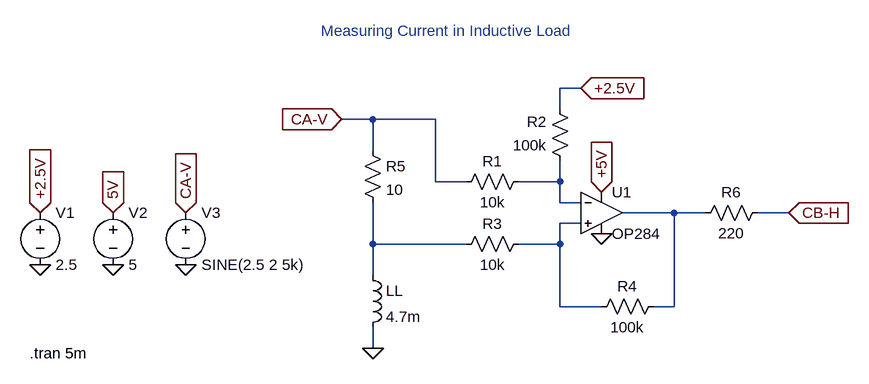
[diagram p0: schematic measuring_current_ind_load_ltspice.asc]
measuring_current_ind_load_ltspice.asc, the LTspice schematic file:
Version 4
SHEET 1 880 680
WIRE 256 240 224 240
WIRE 224 272 224 240
WIRE -64 288 -112 288
WIRE 32 288 -64 288
WIRE -64 336 -64 288
WIRE 32 384 32 288
WIRE 80 384 32 384
WIRE 224 384 224 352
WIRE 224 384 160 384
WIRE 224 416 224 384
WIRE 256 416 224 416
WIRE 400 432 320 432
WIRE 448 432 400 432
WIRE 576 432 528 432
WIRE 256 448 224 448
WIRE -64 480 -64 416
WIRE 80 480 -64 480
WIRE 224 480 224 448
WIRE 224 480 160 480
WIRE -64 528 -64 480
WIRE 224 576 224 480
WIRE 288 576 224 576
WIRE 400 576 400 432
WIRE 400 576 368 576
WIRE -64 640 -64 608
FLAG 288 464 0
FLAG 288 400 +5V
IOPIN 288 400 In
FLAG -112 288 CA-V
IOPIN -112 288 In
FLAG 256 240 +2.5V
IOPIN 256 240 In
FLAG 576 432 CB-H
IOPIN 576 432 In
FLAG -64 640 0
FLAG -576 512 0
FLAG -464 512 0
FLAG -352 512 0
FLAG -576 432 +2.5V
IOPIN -576 432 In
FLAG -464 432 5V
IOPIN -464 432 In
FLAG -352 432 CA-V
IOPIN -352 432 In
SYMBOL Opamps\\OP284 288 368 R0
SYMATTR InstName U1
SYMBOL res 176 368 R90
WINDOW 0 0 56 VBottom 2
WINDOW 3 32 56 VTop 2
SYMATTR InstName R1
SYMATTR Value 10k
SYMBOL res 240 368 R180
WINDOW 0 36 76 Left 2
WINDOW 3 36 40 Left 2
SYMATTR InstName R2
SYMATTR Value 100k
SYMBOL res 64 496 R270
WINDOW 0 32 56 VTop 2
WINDOW 3 0 56 VBottom 2
SYMATTR InstName R3
SYMATTR Value 10k
SYMBOL res 272 592 R270
WINDOW 0 32 56 VTop 2
WINDOW 3 0 56 VBottom 2
SYMATTR InstName R4
SYMATTR Value 100k
SYMBOL res -80 320 R0
SYMATTR InstName R5
SYMATTR Value 10
SYMBOL res 544 416 R90
WINDOW 0 0 56 VBottom 2
WINDOW 3 32 56 VTop 2
SYMATTR InstName R6
SYMATTR Value 220
SYMBOL voltage -576 416 R0
WINDOW 123 0 0 Left 0
WINDOW 39 0 0 Left 0
SYMATTR InstName V1
SYMATTR Value 2.5
SYMBOL voltage -464 416 R0
WINDOW 123 0 0 Left 0
WINDOW 39 0 0 Left 0
SYMATTR InstName V2
SYMATTR Value 5
SYMBOL voltage -352 416 R0
WINDOW 123 0 0 Left 0
WINDOW 39 0 0 Left 0
SYMATTR InstName V3
SYMATTR Value SINE(2.5 2 5k)
SYMBOL ind -80 512 R0
SYMATTR InstName LL
SYMATTR Value 4.7m
TEXT -144 152 Left 2 ;Measuring Current in Inductive Load
TEXT -592 648 Left 2 !.tran 5m

The netlist it stands for:
* measuring_current_ind_load_ltspice.asc
XU1 N003 N001 +5V 0 N002 OP284  ; pins In+ In- V+ V- OUT
R1 N001 CA-V 10k
R2 N001 +2.5V 100k
R3 N004 N003 10k
R4 N003 N002 100k
R5 CA-V N004 10
R6 CB-H N002 220
V1 +2.5V 0 2.5
V2 5V 0 5
V3 CA-V 0 SINE(2.5 2 5k)
LL N004 0 4.7m
* Measuring Current in Inductive Load
.tran 5m
.lib ADI1.lib
.backanno
.end